# EAGLE design app_rs232_smd (EAGLE 5.04)
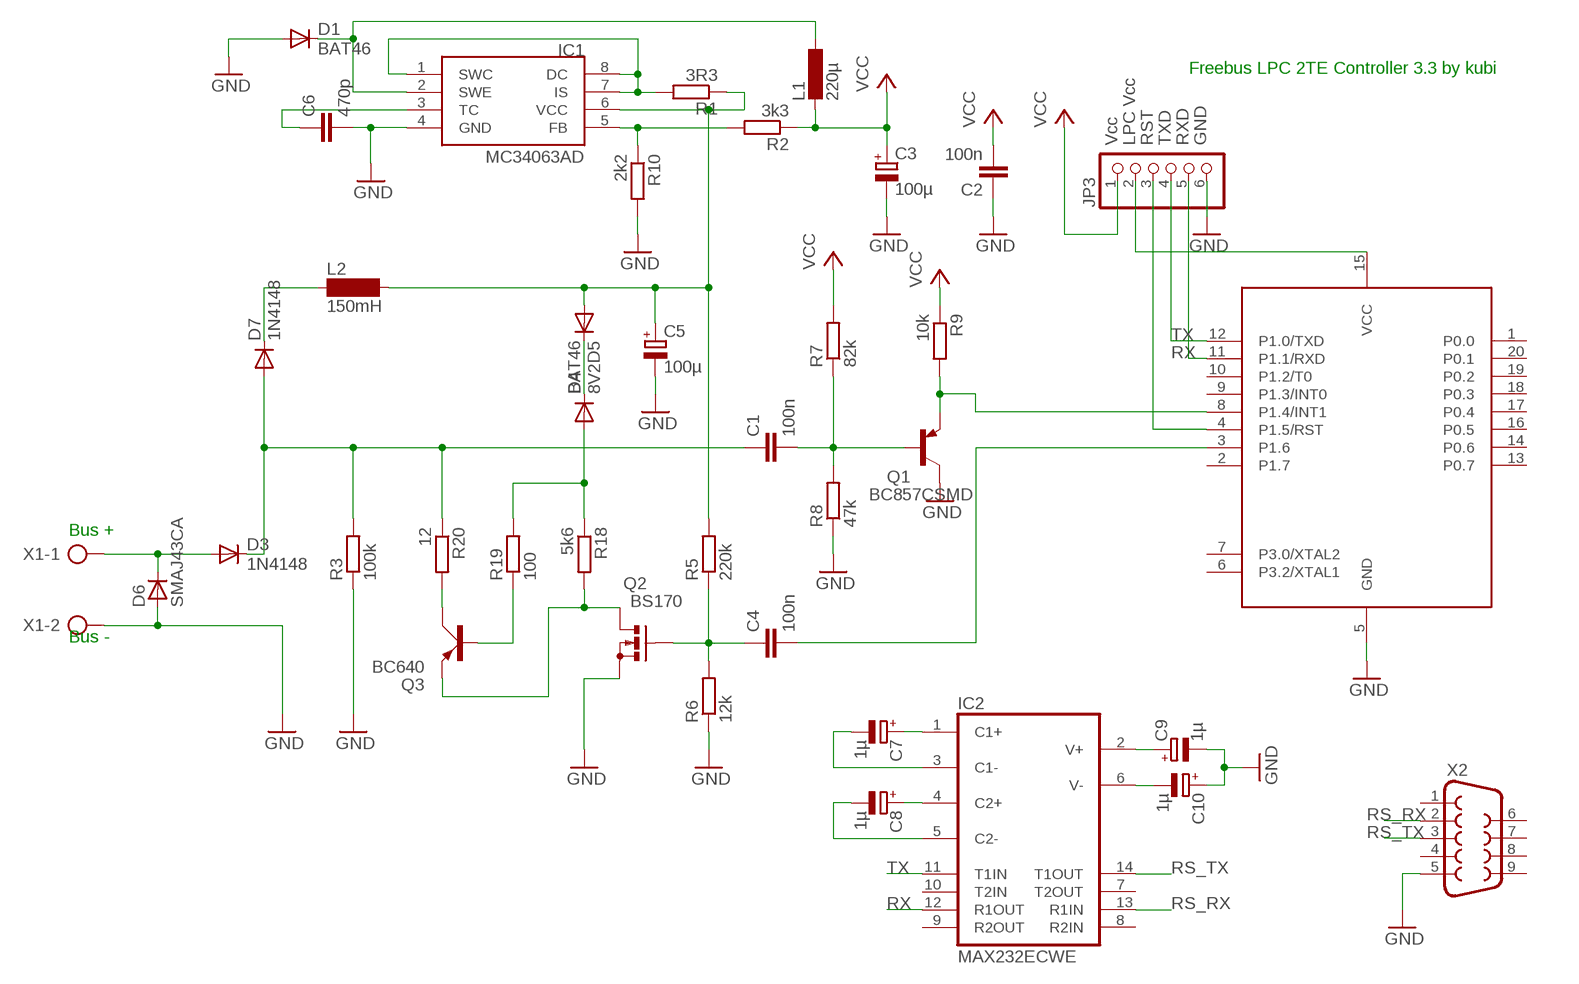
[diagram p0: schematic, sheet 1]

## Parts
C1  100n  C-EUC1206  [C1206]
C2  100n  C-EUC1206  [C1206]
C3  100µ  CPOL-EUE3.5-8  [E3,5-8]
C4  100n  C-EUC1206  [C1206]
C5  100µ  CPOL-EUE3.5-8  [E3,5-8]
C6  470p  C-EUC0805  [C0805]
C7  1µ  CPOL-EUE2,5-6E  [E2,5-6E]
C8  1µ  CPOL-EUE2,5-6E  [E2,5-6E]
C9  1µ  CPOL-EUE2,5-6E  [E2,5-6E]
C10  1µ  CPOL-EUE2,5-6E  [E2,5-6E]
D1  BAT46  DIODE-MINIMELF  [MINIMELF]
D3  1N4148  DIODE-MINIMELF  [MINIMELF]
D4  8V2  DIODE-MINIMELF  [MINIMELF]
D5  BAT46  DIODE-MINIMELF  [MINIMELF]
D6  SMAJ43CA  D-SMB  [SMB]
D7  1N4148  DIODE-MINIMELF  [MINIMELF]
IC1  MC34063AD  [SOIC8]
IC2  MAX232ECWE  [SO16L]
JP3  PINHD-1X6  [1X06]
L1  220µ  L-EU0207/10  [0207/10]
L2  150mH  SD12-1000  [SD12_1000]
Q1  BC857CSMD  [SOT23-BEC]
Q2  BS170  [SOT54E]
Q3  BC640  [SOT54D]
R1  3R3  R-EU_M0805  [M0805]
R2  3k3  R-EU_M0805  [M0805]
R3  100k  R-EU_R0805  [R0805]
R5  220k  R-EU_M0805  [M0805]
R6  12k  R-EU_M0805  [M0805]
R7  82k  R-EU_M0805  [M0805]
R8  47k  R-EU_M0805  [M0805]
R9  10k  R-EU_M0805  [M0805]
R10  2k2  R-EU_M0805  [M0805]
R18  5k6  R-EU_M0805  [M0805]
R19  100  R-EU_M0805  [M0805]
R20  12  R-EU_M0805  [M0805]
U1  89LPC922  [TSSOP20]
X1  AK500/2  [AK500/2]
X2  F09VB  [F09VB]

## Nets
GND: C2.1 C3.- C5.- C6.2 C9.- C10.+ D1.A D6.2(A) IC1.4(GND) JP3.6 Q1.C Q2.S R3.1 R6.1 R8.1 R10.2 U1.5(GND) X1.2 X2.5
N$1: Q1.E R9.2 U1.8(P1.4/INT1)
N$2: C4.2 U1.3(P1.6)
N$3: C7.+ IC2.1(C1+)
N$4: C1.1 D3.C D7.A R3.2 R20.1
N$6: Q2.D Q3.E R18.2
N$7: C7.- IC2.3(C1-)
N$8: IC1.1(SWC) IC1.7(IS) IC1.8(DC) R1.2
N$9: C8.+ IC2.4(C2+)
N$10: C5.+ D5.A IC1.6(VCC) L2.2 R1.1 R5.2
N$11: IC1.5(FB) R2.2 R10.1
N$12: D1.C IC1.2(SWE) L1.1
N$13: D4.C D5.C
N$14: C6.1 IC1.3(TC)
N$15: D3.A D6.1(C) X1.1
N$17: C8.- IC2.5(C2-)
N$18: C9.+ IC2.2(V+)
N$19: C10.- IC2.6(V-)
N$25: D4.A R18.1 R19.2
N$26: Q3.B R19.1
N$27: D7.C L2.1
N$28: Q3.C R20.2
N$31: JP3.3 U1.4(P1.5/RST)
N$32: JP3.2 U1.15(VCC)
N$33: C4.1 Q2.G R5.1 R6.2
N$34: C1.2 Q1.B R7.1 R8.2
RS_RX: IC2.13(R1IN) X2.2
RS_TX: IC2.14(T1OUT) X2.3
RX: IC2.12(R1OUT) JP3.5 U1.11(P1.1/RXD)
TX: IC2.11(T1IN) JP3.4 U1.12(P1.0/TXD)
VCC: C2.2 C3.+ JP3.1 L1.2 R2.1 R7.2 R9.1
Unconnected: IC2.7(T2OUT) IC2.8(R2IN) IC2.9(R2OUT) IC2.10(T2IN) U1.1(P0.0) U1.2(P1.7) U1.6(P3.2/XTAL1) U1.7(P3.0/XTAL2) U1.9(P1.3/INT0) U1.10(P1.2/T0) U1.13(P0.7) U1.14(P0.6) U1.16(P0.5) U1.17(P0.4) U1.18(P0.3) U1.19(P0.2) U1.20(P0.1) X2.1 X2.4 X2.6 X2.7 X2.8 X2.9

## Notes on the sheet
- Freebus LPC 2TE Controller 3.3 by kubi
- Vcc | LPC Vcc | RST | TXD | RXD | GND
- Bus +
- Bus -

## Power pins joined to a net without a drawn wire
GND: IC2.15(GND)
VCC: IC2.16(VCC)

## Library data of the parts
C1 C2 C4 C6 = rcl:C-EU: CAPACITOR, European symbol
C3 C5 C7-C10 = rcl:CPOL-EU: POLARIZED CAPACITOR, European symbol
D1 D3-D5 D7 = diode:DIODE-: DIODE
D6 = semicon-smd-ipc:D-: DIODE unfilled
IC1 = mc34063:MC34063
IC2 = maxim:MAX232ECWE: RS232 TRANSEIVER
JP3 = pinhead:PINHD-1X6: PIN HEADER
L1 = rcl:L-EU: INDUCTOR, European symbol
L2 = inductor-neosid:SD12: INDUCTOR nominal inductance
Q1 = transistor-pnp:BC857*: PNP Transistror
Q2 = transistor-small-signal:BS170: N-CHANNEL MOS FET
Q3 = transistor-small-signal:BC640: PNP TRANSISTOR
R1-R3 R5-R10 R18-R20 = rcl:R-EU_: RESISTOR, European symbol
U1 = lpc:89LPC922
X1 = con-ptr500:AK500/2: CONNECTOR
X2 = con-subd:F09: SUB-D

## Board
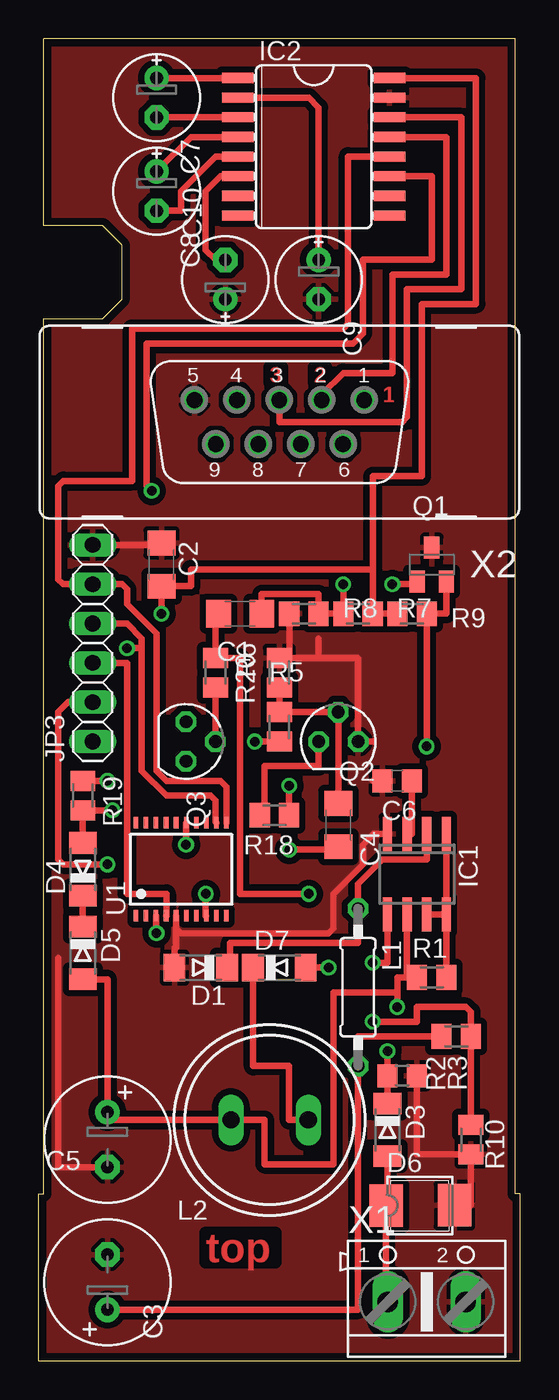
[diagram p1: board, top side]
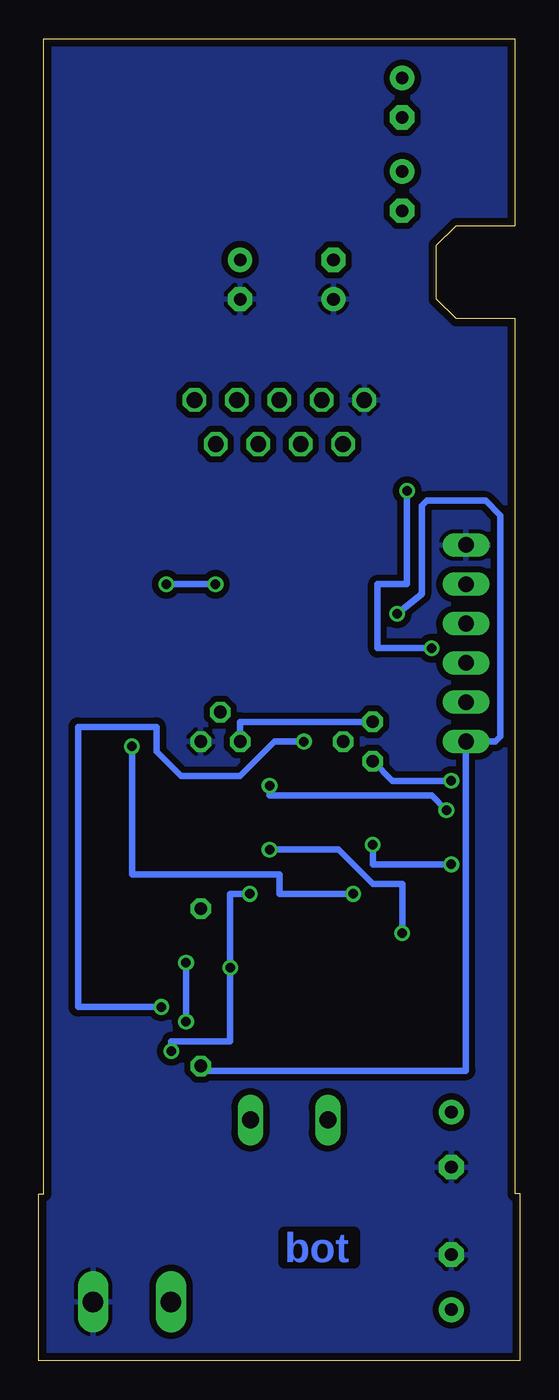
[diagram p2: board, bottom side, seen from below]

Size 31.11 x 85.41 mm. Coordinates in mm from the lower left corner, seen from the top.
Outline: 0,0 0,10.79 0.32,10.79 0.32,67.31 4.13,67.31 5.4,68.58 5.4,72.07 4.13,73.34 0.32,73.34 0.32,85.41 30.8,85.41 30.8,10.79 31.11,10.79 31.11,0 0,0
Copper layers (1*16): Top 0.035mm / dielectric 1.5mm / Bottom 0.035mm
Design rules "default *": minimum track width 14mil, minimum drill 24mil, track to track 8mil, track to pad 8mil, pad to pad 10mil, via to via 10mil, smd to smd 8mil, copper to edge 20mil, drill to drill 8mil, minimum pad ring 10mil, minimum via ring 8mil, stop-mask expansion 4mil, vias tented up to drill 0mil, thermal gap 10mil

### Footprints (pad centres in the part's own frame; a part is rotated, then mirrored left to right if it is on the bottom)
C1206 = smd 1.6 x 1.8: 1 -1.4,0; 2 1.4,0
E3,5-8 = drill 0.813 pad 1.6 round: + -1.778,0 | drill 0.813 pad 1.6 octagon: - 1.778,0
C0805 = smd 1.3 x 1.5: 1 -0.95,0; 2 0.95,0
E2,5-6E = drill 0.813 pad 1.575 round: + -1.27,0 | drill 0.813 pad 1.575 octagon: - 1.27,0
MINIMELF = smd 1.4 x 1.8: A 1.7,0; C -1.7,0
SMB = smd 2.159 x 2.743: 1 -2.311,-0.127; 2 2.108,-0.102
SOIC8 = smd 0.6 x 2.2: 1 -1.905,-2.6; 2 -0.635,-2.6; 3 0.635,-2.6; 4 1.905,-2.6; 5 1.905,2.6; 6 0.635,2.6; 7 -0.635,2.6; 8 -1.905,2.6
SO16L = smd 0.66 x 2.032: 1 -4.445,-4.902; 2 -3.175,-4.902; 3 -1.905,-4.902; 4 -0.635,-4.902; 5 0.635,-4.902; 6 1.905,-4.902; 7 3.175,-4.902; 8 4.445,-4.902; 9 4.445,4.902; 10 3.175,4.902; 11 1.905,4.902; 12 0.635,4.902; 13 -0.635,4.902; 14 -1.905,4.902; 15 -3.175,4.902; 16 -4.445,4.902
1X06 = drill 1.016 long: 1 -6.35,0; 2 -3.81,0; 3 -1.27,0; 4 1.27,0; 5 3.81,0; 6 6.35,0
0207/10 = drill 0.813 octagon: 1 -5.08,0; 2 5.08,0
SD12_1000 = drill 1.1 long: 1 -2.5,0; 2 2.5,0
SOT23-BEC = smd 1 x 1.4: B -0.95,-1.1; C 0,1.1; E 0.95,-1.1
SOT54E = drill 0.813 octagon: D -1.27,0; G 0,1.905; S 1.27,0
SOT54D = drill 0.813 octagon: B 1.27,0; C 0,1.905; E -1.27,0
M0805 = smd 1.3 x 1.6: 1 -0.95,0; 2 0.95,0
R0805 = smd 1.3 x 1.5: 1 -0.95,0; 2 0.95,0
TSSOP20 = smd 0.3 x 0.75: 1 -2.925,-3; 2 -2.275,-3; 3 -1.625,-3; 4 -0.975,-3; 5 -0.325,-3; 6 0.325,-3; 7 0.975,-3; 8 1.625,-3; 9 2.275,-3; 10 2.925,-3; 11 2.925,3; 12 2.275,3; 13 1.625,3; 14 0.975,3; 15 0.325,3; 16 -0.325,3; 17 -0.975,3; 18 -1.625,3; 19 -2.275,3; 20 -2.925,3
AK500/2 = drill 1.321 long: 1 -2.515,0; 2 2.515,0
F09VB = drill 1.016 octagon: 1 -5.486,-1.422; 2 -2.743,-1.422; 3 0,-1.422; 4 2.743,-1.422; 5 5.486,-1.422; 6 -4.115,1.422; 7 -1.372,1.422; 8 1.372,1.422; 9 4.115,1.422

### Placement (x,y rotation side)
C1  13.02,48.26 0 top
C2  7.94,51.44 270 top
C3  4.45,5.08 90 top
C4  19.37,34.61 270 top
C5  4.45,14.29 270 top
C6  23.18,37.47 180 top
C7  7.62,81.6 270 top
C8  7.62,75.56 270 top
C9  18.1,69.85 270 top
C10  12.06,69.85 90 top
D1  10.48,25.4 180 top
D3  22.54,14.92 270 top
D4  2.86,31.75 90 top
D5  2.86,26.35 270 top
D6  24.77,10.16 0 top
D7  15.56,25.4 0 top
IC1  24.45,31.43 180 top
IC2  17.78,78.42 270 top
JP3  3.49,46.35 90 top
L1  20.64,24.13 270 top
L2  14.92,15.56 180 top
Q1  25.4,51.44 0 top
Q2  19.37,40.01 0 top
Q3  9.53,40.01 270 top
R1  25.4,24.77 0 top
R2  26.99,20.95 0 top
R3  23.5,18.41 180 top
R5  15.56,40.96 270 top
R6  15.56,44.45 270 top
R7  20.64,48.26 0 top
R8  17.14,48.26 0 top
R9  24.13,48.26 0 top
R10  27.94,14.29 270 top
R18  15.24,35.24 180 top
R19  2.86,36.51 270 top
R20  11.43,44.45 270 top
U1  9.21,31.75 0 top
X1  25.08,3.81 0 top
X2  15.56,60.64 180 top

### Tracks (layer width: path | path; a pad name or v marks a point on that pad's centre or on a via)
GND
  Top 0.406: U1.5 8.89,27.94 | 8.89,27.94 8.89,26.67 8.78,26.67 D1.A 8.78,26.04 | X1.2 26.87,3.81 | D6.2 27.94,10.06 R10.2 24.45,13.34 R3.1 | C5.- 1.27,12.51 1.27,26.04 | C6.2 21.59,37.47 | 21.59,40.01 Q2.S 20.64,45.4 18.1,45.4 | 18.1,45.4 15.24,45.4 R6.1 16.2,45.4 R8.1 | JP3.6 7.94,52.7 C2.1 | 18.1,45.4 18.1,46.67 | IC1.4 21.65,34.03 20.95,33.34 20.95,32.07 19.05,30.16 19.05,27.94 18.73,27.62 9.21,27.62 8.89,27.94
  pour Top (isolate 0.406): 0.32,85.72 30.8,85.72 30.48,52.7 30.48,0 0,0 0,48.26
  pour Bottom (isolate 0.406): 0.32,85.72 30.8,85.72 30.48,52.39 30.48,0 0,0
N$1  (via drill 0.61)
  Top 0.406: U1.8 10.79,28.75 v10.79,30.16 | v25.08,39.69 25.08,46.04 R9.2 26.35,48.26 Q1.E
  Bottom 0.406: v10.79,30.16 15.56,30.16 15.56,31.43 25.08,31.43 v25.08,39.69
N$2  (via drill 0.61)
  Top 0.406: U1.3 7.58,27.66 v7.62,27.62 | v16.19,33.02 18.92,33.02 C4.2
  Bottom 0.406: v7.62,27.62 7.62,30.8 9.53,30.8 11.75,33.02 v16.19,33.02
N$3
  Top 0.406: C7.+ IC2.1
N$4  (via drill 0.61)
  Top 0.406: D3.C R3.2 22.55,19.68 v22.54,20 | C1.1 11.43,48.26 R20.1 13.02,45.4 13.02,30.16 v17.46,30.16 | v18.73,25.4 D7.A
  Bottom 0.406: v17.46,30.16 18.73,30.16 v18.73,25.4 18.73,20.64 22.54,20.64 v22.54,20
N$6
  Top 0.406: R18.2 14.61,35.88 14.61,38.42 18.1,38.42 Q2.D
  Bottom 0.406: Q3.E 18.1,41.27 Q2.D
N$7
  Top 0.406: C7.- IC2.3
N$8
  Top 0.406: R1.2 IC1.8 | IC1.8 IC1.7 | IC1.8 IC1.1
N$9
  Top 0.406: IC2.4 9.84,79.06 C8.+
N$10  (via drill 0.61)
  Top 0.406: D5.A 4.45,24.65 C5.+ 4.45,15.56 L2.2 14.61,15.56 14.61,12.7 19.05,12.7 19.05,23.81 23.18,23.81 | 23.81,24.77 R1.1 | 23.81,24.77 IC1.6 | 23.18,23.81 23.18,24.77 23.81,24.77 | R5.2 v13.97,40.01 | 23.18,23.81 v23.18,22.86
  Bottom 0.406: v13.97,40.01 15.88,40.01 18.1,37.78 21.91,37.78 23.5,39.37 23.5,40.96 28.57,40.96 28.57,22.86 v23.18,22.86
N$11  (via drill 0.61)
  Top 0.406: R10.1 R2.2 27.94,22.55 27.62,22.86 24.45,22.86 24.45,21.91 v21.59,21.91 | v21.59,25.72 22.54,25.72 IC1.5
  Bottom 0.406: v21.59,21.91 v21.59,25.72
N$12
  Top 0.406: D1.C 12.38,25.4 12.38,26.99 20.64,26.99 L1.1 20.64,30.8 22.23,32.38 25.08,32.38 IC1.2
N$13
  Top 0.406: D5.C D4.C
N$14
  Top 0.406: IC1.3 24.13,34.03 C6.1
N$15
  Top 0.406: X1.1 22.45,3.81 D6.1 22.54,10.03 D3.A
N$17
  Top 0.406: IC2.5 11.43,77.79 9.21,75.56 9.21,74.3 C8.-
N$18
  Top 0.406: IC2.2 17.46,81.6 18.1,80.96 C9.+
N$19
  Top 0.406: IC2.6 11.75,76.52 10.79,75.56 10.79,71.75 11.43,71.12 C10.-
N$25  (via drill 0.61)
  Top 0.406: D4.A R19.2 3.5,35.56 v4.76,35.56 | v16.19,37.15 R18.1
  Bottom 0.406: v16.19,37.15 16.19,36.51 5.71,36.51 v4.76,35.56
N$26  (via drill 0.61)
  Top 0.406: 3.49,37.47 R19.1 v4.44,37.46 v4.45,37.47
  Bottom 0.406: v4.45,37.47 8.26,37.47 Q3.B
N$27
  Top 0.406: L2.1 16.19,15.56 16.19,19.05 13.86,19.05 D7.C
N$28
  Top 0.406: Q3.C R20.2
N$31
  Top 0.406: U1.4 8.26,28.75 8.26,30.16 5.71,30.16 5.71,45.09 JP3.3
N$32  (via drill 0.61)
  Top 0.406: JP3.2 1.91,42.55 1.27,41.91 1.27,32.38 1.59,32.07 v4.45,32.07 | U1.15 v9.53,33.34
  Bottom 0.406: v9.53,33.34 9.53,32.07 v4.45,32.07
N$33
  Top 0.406: R6.2 R5.1 19.05,41.91 Q2.G C4.1
N$34  (via drill 0.61)
  Top 0.406: C1.2 14.42,49.53 18.1,49.53 R8.2 R7.1 v19.68,50.16 | v22.86,50.16 24.45,50.16 Q1.B
  Bottom 0.406: v19.68,50.16 v22.86,50.16
RS_RX
  Top 0.406: X2.2 18.3,62.43 19.68,63.82 22.86,63.82 22.86,70.17 26.35,70.17 26.35,79.06 IC2.13
RS_TX
  Top 0.406: IC2.14 27.3,80.33 27.3,69.22 23.81,69.22 23.81,60.96 23.5,60.64 15.56,60.64 X2.3
RX
  Top 0.406: U1.11 12.13,37.08 11.75,37.47 8.26,37.47 7.62,38.1 7.62,46.99 5.71,48.9 5.71,49.85 5.4,50.16 JP3.5 1.59,50.16 1.27,50.48 1.27,56.52 1.59,56.83 6.03,56.83 6.03,66.67 19.68,66.67 20,66.99 20,77.79 IC2.12
TX  (via drill 0.61)
  Top 0.406: JP3.4 5.71,47.62 6.67,46.67 6.67,46.04 | 6.67,46.04 6.67,38.1 8.26,36.51 11.11,36.51 11.43,36.2 11.43,34.8 U1.12 | IC2.11 25.4,76.52 25.4,71.12 20.95,71.12 20.95,66.36 20.32,65.72 6.99,65.72 6.99,56.52 v7.3,56.2 | 6.67,46.04 v5.71,46.04
  Bottom 0.406: v7.3,56.2 7.3,50.16 9.21,50.16 9.21,46.04 v5.71,46.04
VCC  (via drill 0.61)
  Top 0.406: C3.+ 20.64,3.3 L1.2 20.64,20.95 R2.1 | C2.2 7.3,50.03 | 21.59,50.8 R7.2 R9.1 | 21.59,50.8 21.59,50.99 | C2.2 9.84,50.03 9.84,51.12 21.59,51.12 | 21.59,51.12 21.59,50.8 | 21.59,51.12 21.59,57.15 24.77,57.15 24.77,68.26 28.26,68.26 28.26,82.87 IC2.16 | v7.94,48.26 C2.2
  Bottom 0.406: v7.94,48.26 6.35,49.53 6.35,55.24 6.03,55.56 2.22,55.56 1.27,54.61 1.27,40.32 1.59,40.01 JP3.1 3.49,18.73 20.32,18.73 L1.2

### Text on the board
Top: 3 | 2 | 1 | top
Bottom: bot